# EAGLE board PolyDAC (EAGLE 5.11)
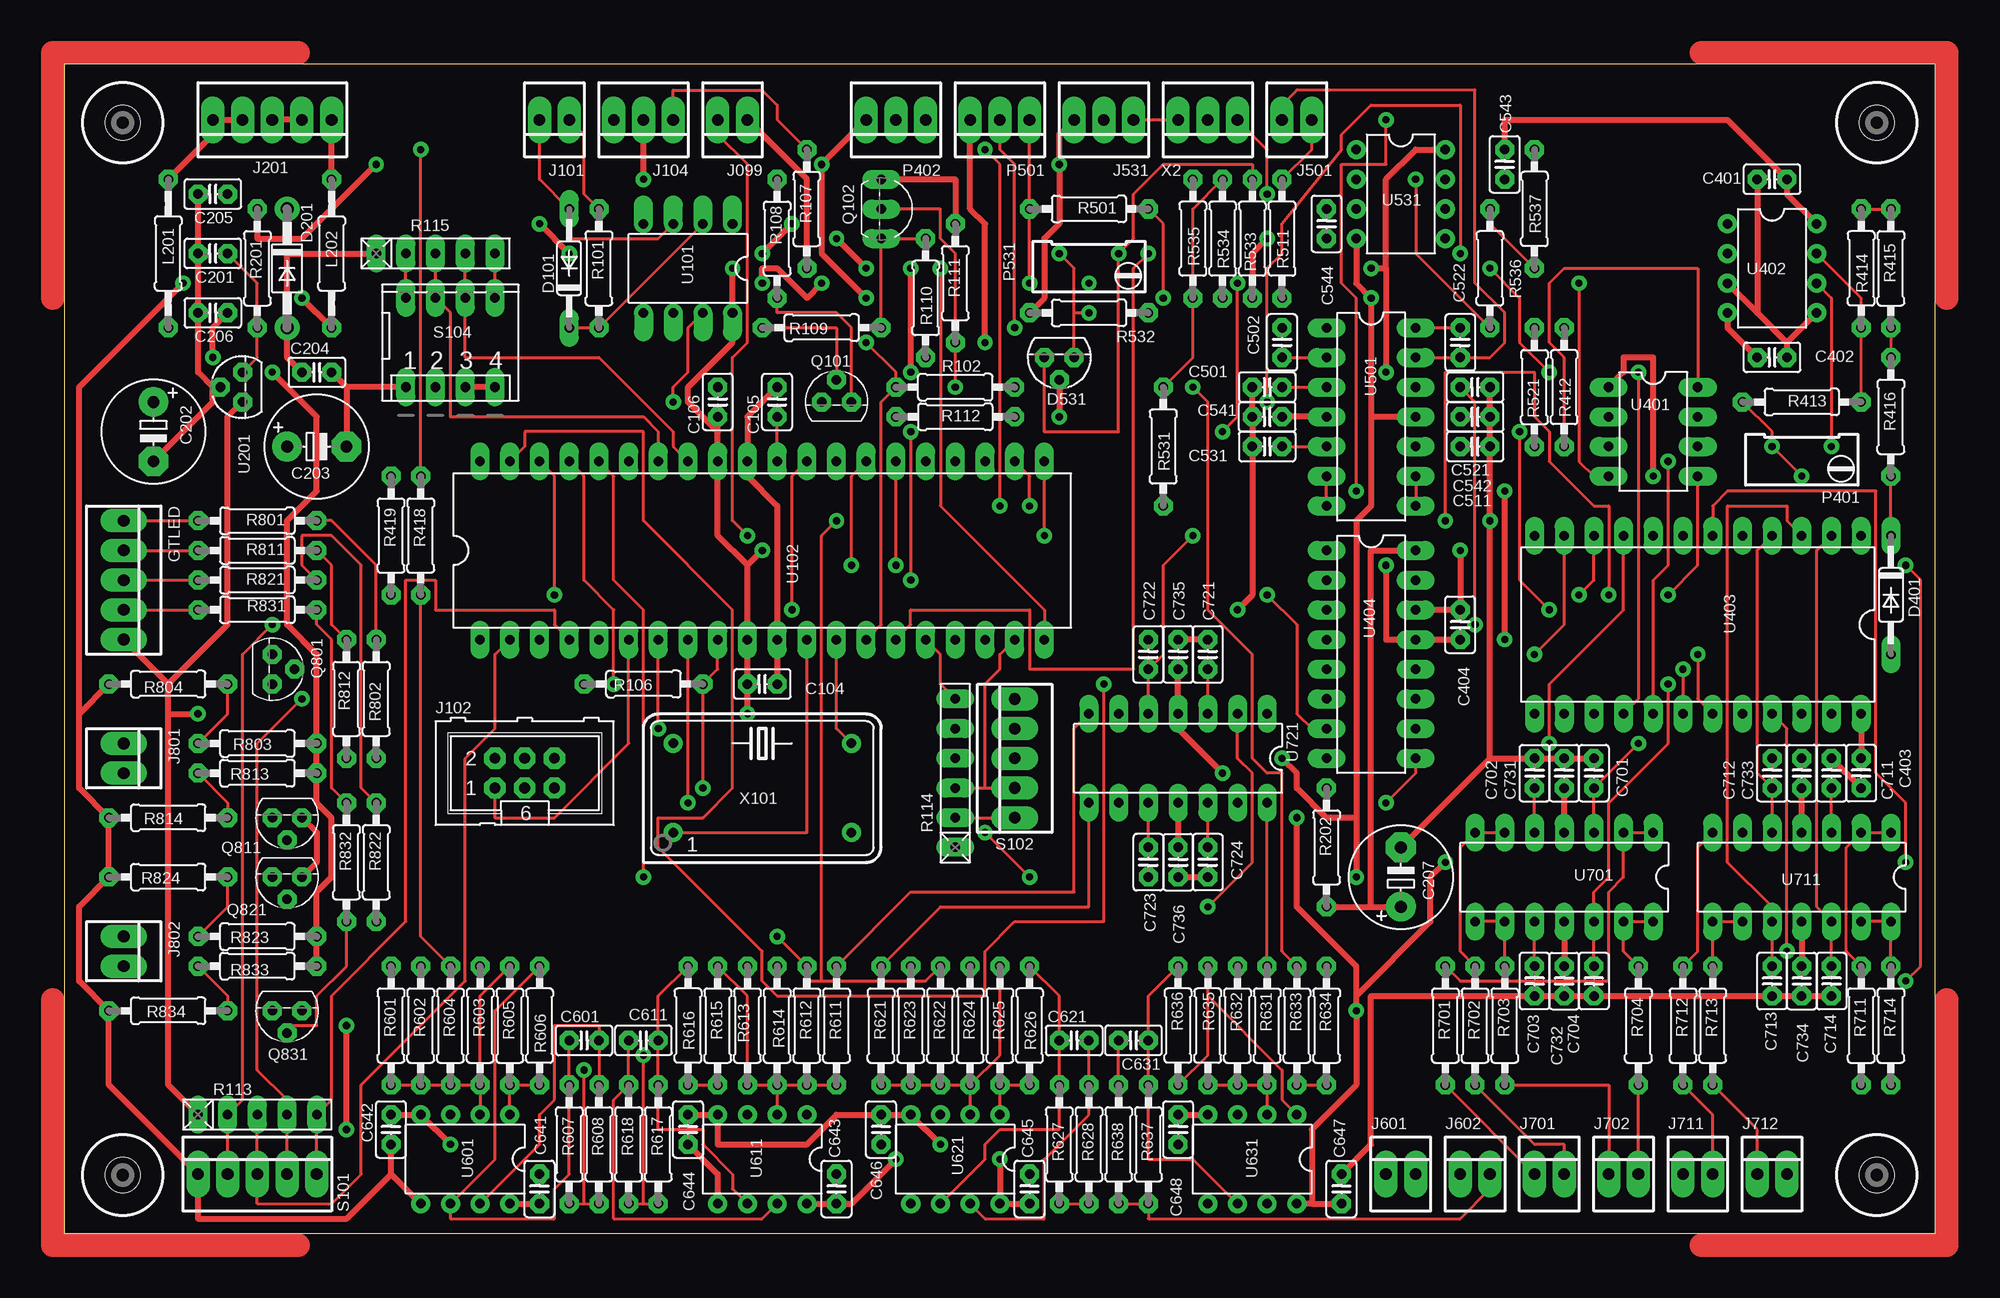
[diagram p8: board, top side]
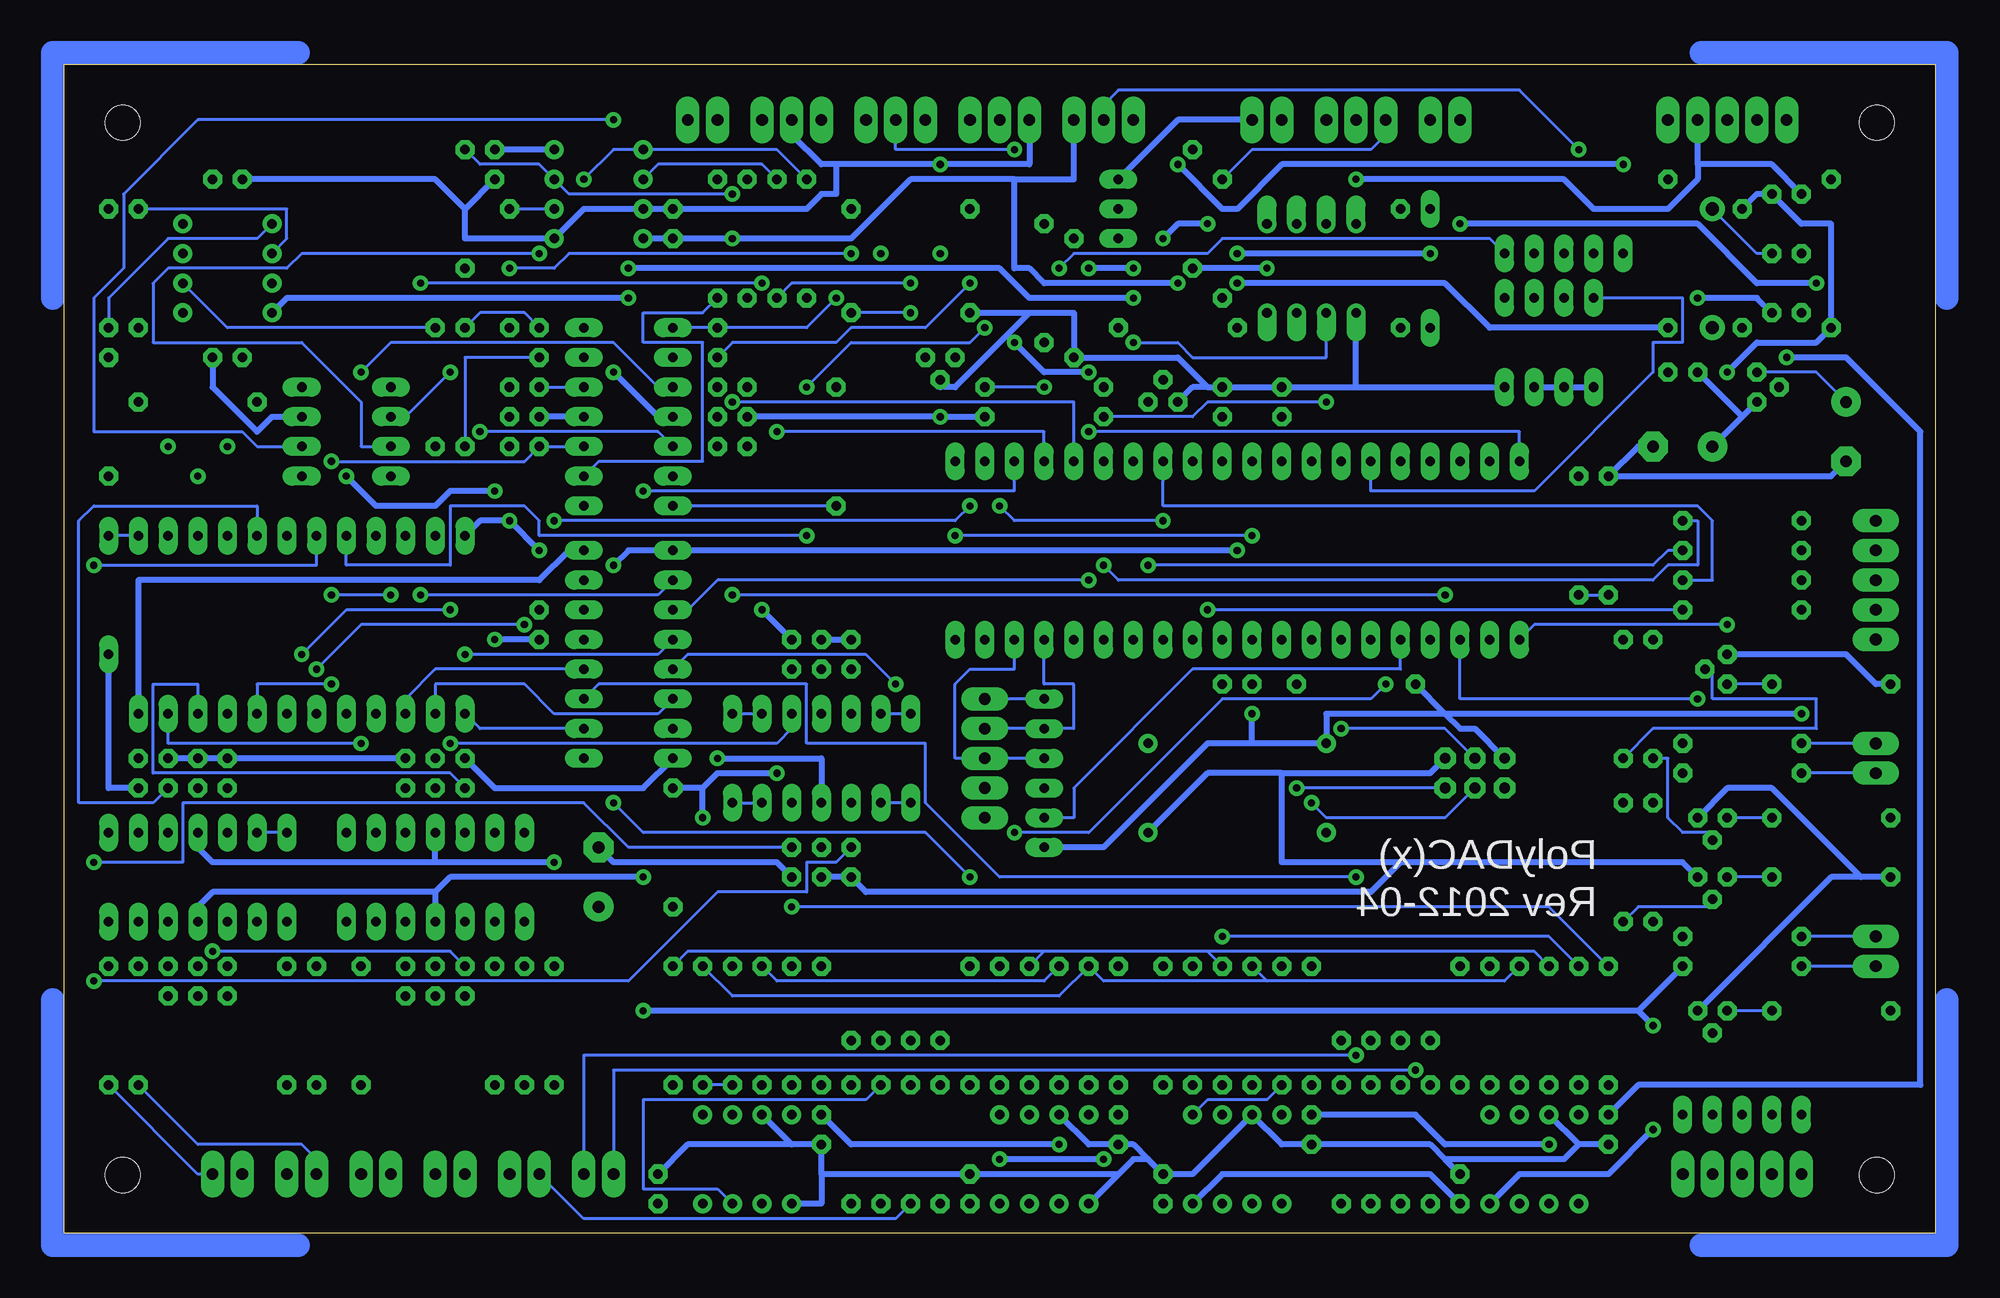
[diagram p9: board, bottom side, seen from below]

Size 160 x 100 mm. Coordinates in mm from the lower left corner, seen from the top.
Outline: 0,0 160,0 160,100 0,100 0,0
Copper layers (1*16): Top 0.035mm / dielectric 1.5mm / Bottom 0.035mm
Design rules "default *": minimum track width 10mil, minimum drill 24mil, track to track 12mil, track to pad 12mil, pad to pad 12mil, via to via 12mil, smd to smd 8mil, copper to edge 40mil, drill to drill 8mil, minimum pad ring 14mil, minimum via ring 14mil, stop-mask expansion 4mil, vias tented up to drill 0mil, thermal gap 10mil
Net classes: 1 bold: width 0.508 mm

## Footprints (pad centres in the part's own frame; a part is rotated, then mirrored left to right if it is on the bottom)
C025-025X050 = drill 0.813 octagon: 1 -1.27,0; 2 1.27,0
E5-8,5 = drill 1.016 pad 2.54 round: + -2.54,0 | drill 1.016 pad 2.54 octagon: - 2.54,0
DO35-10 = drill 0.813 long: A 5.08,0; C -5.08,0
DO41-10 = drill 1.118 round: A 5.08,0; C -5.08,0
TO92 = drill 0.813 octagon: 1 -1.27,0; 2 0,1.905; 3 1.27,0
22-23-2051 = drill 1 long: 1 -5.08,0; 2 -2.54,0; 3 0,0; 4 2.54,0; 5 5.08,0
22-23-2021 = drill 1 long: 1 -1.27,0; 2 1.27,0
ML6 = drill 0.914 octagon: 1 -2.54,-1.27; 2 -2.54,1.27; 3 0,-1.27; 4 0,1.27; 5 2.54,-1.27; 6 2.54,1.27
22-23-2031 = drill 1 long: 1 -2.54,0; 2 0,0; 3 2.54,0
0207/12 = drill 0.813 octagon: 1 -6.35,0; 2 6.35,0
RTRIM64Y = drill 0.61 round: 1 0,-2.54; 2 -2.54,0; 3 0,2.54
TO92' = drill 0.813 octagon: 1 1.27,0; 2 0,1.905; 3 -1.27,0
TO92-EBC = drill 0.813 long: B 0,-1.27; C 2.54,-1.27; E -2.54,-1.27
0207/10 = drill 0.813 octagon: 1 -5.08,0; 2 5.08,0
RN-5 = drill 0.813 long: 1 -5.08,0; 2 -2.54,0; 3 0,0; 4 2.54,0; 5 5.08,0
RN-6 = drill 0.813 long: 1 -6.35,0; 2 -3.81,0; 3 -1.27,0; 4 1.27,0; 5 3.81,0; 6 6.35,0
DP-04 = drill 0.813 long: 1 -3.81,-3.81; 2 -1.27,-3.81; 3 1.27,-3.81; 4 3.81,-3.81; 5 3.81,3.81; 6 1.27,3.81; 7 -1.27,3.81; 8 -3.81,3.81
DIL08 = drill 0.813 offset: 1 -3.81,-3.81; 2 -1.27,-3.81; 3 1.27,-3.81; 4 3.81,-3.81; 5 3.81,3.81; 6 1.27,3.81; 7 -1.27,3.81; 8 -3.81,3.81
DIL40 = drill 0.813 long: 1 -24.13,-7.62; 2 -21.59,-7.62; 3 -19.05,-7.62; 4 -16.51,-7.62; 5 -13.97,-7.62; 6 -11.43,-7.62; 7 -8.89,-7.62; 8 -6.35,-7.62; 9 -3.81,-7.62; 10 -1.27,-7.62; 11 1.27,-7.62; 12 3.81,-7.62; 13 6.35,-7.62; 14 8.89,-7.62; 15 11.43,-7.62; 16 13.97,-7.62; 17 16.51,-7.62; 18 19.05,-7.62; 19 21.59,-7.62; 20 24.13,-7.62; 21 24.13,7.62; 22 21.59,7.62; 23 19.05,7.62; 24 16.51,7.62; 25 13.97,7.62; 26 11.43,7.62; 27 8.89,7.62; 28 6.35,7.62; 29 3.81,7.62; 30 1.27,7.62; 31 -1.27,7.62; 32 -3.81,7.62; 33 -6.35,7.62; 34 -8.89,7.62; 35 -11.43,7.62; 36 -13.97,7.62; 37 -16.51,7.62; 38 -19.05,7.62; 39 -21.59,7.62; 40 -24.13,7.62
DIL08' = drill 0.813 long: 1 -3.81,-3.81; 2 -1.27,-3.81; 3 1.27,-3.81; 4 3.81,-3.81; 5 3.81,3.81; 6 1.27,3.81; 7 -1.27,3.81; 8 -3.81,3.81
DIL08'' = drill 0.813 pad 1.27 round: 1 -3.81,-3.81; 2 -1.27,-3.81; 3 1.27,-3.81; 4 3.81,-3.81; 5 3.81,3.81; 6 1.27,3.81; 7 -1.27,3.81; 8 -3.81,3.81
DIL24-6 = drill 0.813 long: 1 -13.97,-7.62; 2 -11.43,-7.62; 3 -8.89,-7.62; 4 -6.35,-7.62; 5 -3.81,-7.62; 6 -1.27,-7.62; 7 1.27,-7.62; 8 3.81,-7.62; 9 6.35,-7.62; 10 8.89,-7.62; 11 11.43,-7.62; 12 13.97,-7.62; 13 13.97,7.62; 14 11.43,7.62; 15 8.89,7.62; 16 6.35,7.62; 17 3.81,7.62; 18 1.27,7.62; 19 -1.27,7.62; 20 -3.81,7.62; 21 -6.35,7.62; 22 -8.89,7.62; 23 -11.43,7.62; 24 -13.97,7.62
DIL16 = drill 0.813 long: 1 -8.89,-3.81; 2 -6.35,-3.81; 3 -3.81,-3.81; 4 -1.27,-3.81; 5 1.27,-3.81; 6 3.81,-3.81; 7 6.35,-3.81; 8 8.89,-3.81; 9 8.89,3.81; 10 6.35,3.81; 11 3.81,3.81; 12 1.27,3.81; 13 -1.27,3.81; 14 -3.81,3.81; 15 -6.35,3.81; 16 -8.89,3.81
DIL14 = drill 0.813 long: 1 -7.62,-3.81; 2 -5.08,-3.81; 3 -2.54,-3.81; 4 0,-3.81; 5 2.54,-3.81; 6 5.08,-3.81; 7 7.62,-3.81; 8 7.62,3.81; 9 5.08,3.81; 10 2.54,3.81; 11 0,3.81; 12 -2.54,3.81; 13 -5.08,3.81; 14 -7.62,3.81
DRIL-3 = hole 3: 0,0
DIL14S = drill 0.813 round: 1 -7.62,-3.81; 7 7.62,-3.81; 8 7.62,3.81; 14 -7.62,3.81

## Placement (x,y rotation side)
C104  100nF  [C025-025X050]  59.69,46.99 180 top
C105  100nF  [C025-025X050]  60.96,71.12 90 top
C106  100nF  [C025-025X050]  55.88,71.12 90 top
C201  100nF  [C025-025X050]  12.7,83.82 180 top
C202  22µ 25V  [E5-8,5]  7.62,68.58 270 top
C203  22µ 25V  [E5-8,5]  21.59,67.31 0 top
C204  100nF  [C025-025X050]  21.59,73.66 0 top
C205  100nF  [C025-025X050]  12.7,88.9 180 top
C206  100nF  [C025-025X050]  12.7,78.74 0 top
C207  22µ 25V  [E5-8,5]  114.3,30.48 90 top
C401  100nF  [C025-025X050]  146.05,90.17 180 top
C402  100nF  [C025-025X050]  146.05,74.93 180 top
C403  100nF  [C025-025X050]  153.67,39.37 270 top
C404  100nF  [C025-025X050]  119.38,52.07 90 top
C501  10nF  [C025-025X050]  102.87,72.39 0 top
C502  33pF  [C025-025X050]  104.14,76.2 270 top
C511  10nF  [C025-025X050]  120.65,67.31 180 top
C521  10nF  [C025-025X050]  120.65,72.39 180 top
C522  33pF  [C025-025X050]  119.38,76.2 270 top
C531  10nF  [C025-025X050]  102.87,67.31 0 top
C541  100nF  [C025-025X050]  102.87,69.85 180 top
C542  100nF  [C025-025X050]  120.65,69.85 180 top
C543  100nF  [C025-025X050]  123.19,91.44 90 top
C544  100nF  [C025-025X050]  107.95,86.36 90 top
C601  33pF  [C025-025X050]  44.45,16.51 0 top
C611  33pF  [C025-025X050]  49.53,16.51 180 top
C621  33pF  [C025-025X050]  86.36,16.51 0 top
C631  33pF  [C025-025X050]  91.44,16.51 180 top
C641  100nF  [C025-025X050]  40.64,3.81 90 top
C642  100nF  [C025-025X050]  27.94,8.89 90 top
C643  100nF  [C025-025X050]  66.04,3.81 90 top
C644  100nF  [C025-025X050]  53.34,8.89 90 top
C645  100nF  [C025-025X050]  82.55,3.81 90 top
C646  100nF  [C025-025X050]  69.85,8.89 90 top
C647  100nF  [C025-025X050]  109.22,3.81 90 top
C648  100nF  [C025-025X050]  95.25,8.89 90 top
C701  10nF  [C025-025X050]  130.81,39.37 90 top
C702  10nF  [C025-025X050]  125.73,39.37 90 top
C703  10nF  [C025-025X050]  125.73,21.59 270 top
C704  10nF  [C025-025X050]  130.81,21.59 270 top
C711  10nF  [C025-025X050]  151.13,39.37 90 top
C712  10nF  [C025-025X050]  146.05,39.37 90 top
C713  10nF  [C025-025X050]  146.05,21.59 270 top
C714  10nF  [C025-025X050]  151.13,21.59 270 top
C721  10nF  [C025-025X050]  97.79,49.53 90 top
C722  10nF  [C025-025X050]  92.71,49.53 90 top
C723  10nF  [C025-025X050]  92.71,31.75 270 top
C724  10nF  [C025-025X050]  97.79,31.75 270 top
C731  100nF  [C025-025X050]  128.27,39.37 90 top
C732  100nF  [C025-025X050]  128.27,21.59 90 top
C733  100nF  [C025-025X050]  148.59,39.37 90 top
C734  100nF  [C025-025X050]  148.59,21.59 90 top
C735  100nF  [C025-025X050]  95.25,49.53 90 top
C736  100nF  [C025-025X050]  95.25,31.75 90 top
D101  1N4148  [DO35-10]  43.18,82.55 90 top
D201  1N4004  [DO41-10]  19.05,82.55 270 top
D401  BAT42  [DO35-10]  156.21,54.61 270 top
D531  LM336LP  [TO92]  85.09,74.93 180 top
GTLED  GATELED  [22-23-2051]  5.08,55.88 270 top
J099  MIDI-LED  [22-23-2021]  57.15,95.25 180 top
J101  MIDI-IN  [22-23-2021]  41.91,95.25 180 top
J102  ISP  [ML6]  39.37,39.37 0 top
J104  MIDI-THRU  [22-23-2031]  49.53,95.25 180 top
J201  POWER IN  [22-23-2051]  17.78,95.25 180 top
J501  SUSTAIN AFTERTOUCH  [22-23-2021]  105.41,95.25 180 top
J531  PITCH CV  [22-23-2031]  88.9,95.25 180 top
J601  NOTE 0/1  [22-23-2021]  114.3,5.08 0 top
J602  NOTE 2/3  [22-23-2021]  120.65,5.08 0 top
J701  CC 1/2  [22-23-2021]  127,5.08 0 top
J702  CC 3/4  [22-23-2021]  133.35,5.08 0 top
J711  VELO 0/1  [22-23-2021]  139.7,5.08 0 top
J712  VELO 3/4  [22-23-2021]  146.05,5.08 0 top
J801  GATE 1/2  [22-23-2021]  5.08,40.64 270 top
J802  GATE 3/4  [22-23-2021]  5.08,24.13 270 top
L201  1mH  [0207/12]  8.89,83.82 270 top
L202  1mH  [0207/12]  22.86,83.82 270 top
P401  2K 25T  [RTRIM64Y]  148.59,67.31 90 top
P402  TUNE  [22-23-2031]  71.12,95.25 180 top
P501  MODWHEEL/PITCH  [22-23-2031]  80.01,95.25 180 top
P531  10K 25T  [RTRIM64Y]  87.63,83.82 90 top
Q101  2N3904  [TO92']  66.04,71.12 0 top
Q102  2N3906  [TO92-EBC]  71.12,87.63 270 top
Q801  2N3904  [TO92']  17.78,48.26 270 top
Q811  2N3904  [TO92']  19.05,35.56 180 top
Q821  2N3904  [TO92']  19.05,30.48 180 top
Q831  2N3904  [TO92']  19.05,19.05 180 top
R101  220R  [0207/10]  45.72,82.55 270 top
R102  1K5  [0207/10]  76.2,72.39 0 top
R106  10K  [0207/10]  49.53,46.99 0 top
R107  220R  [0207/10]  63.5,87.63 270 top
R108  220R  [0207/10]  60.96,85.09 270 top
R109  4K7  [0207/10]  64.77,77.47 0 top
R110  33K  [0207/10]  73.66,80.01 90 top
R111  220R  [0207/10]  76.2,81.28 270 top
R112  15K  [0207/10]  76.2,69.85 180 top
R113  4x 1K  [RN-5]  16.51,10.16 0 top
R114  5 x 1K  [RN-6]  76.2,39.37 90 top
R115  4 x 1K  [RN-5]  31.75,83.82 0 top
R201  56R  [0207/10]  16.51,82.55 270 top
R202  100R  [0207/10]  107.95,33.02 270 top
R412  4K7  [0207/10]  128.27,72.39 90 top
R413  11K5  [0207/10]  148.59,71.12 180 top
R414  11K  [0207/10]  153.67,82.55 90 top
R415  22K  [0207/10]  156.21,82.55 270 top
R416  10R  [0207/10]  156.21,69.85 270 top
R418  10k  [0207/10]  30.48,59.69 270 top
R419  1k  [0207/10]  27.94,59.69 270 top
R501  75R  [0207/10]  87.63,87.63 180 top
R511  75R  [0207/10]  104.14,85.09 90 top
R521  75R  [0207/10]  125.73,72.39 270 top
R531  47K  [0207/10]  93.98,67.31 90 top
R532  4K7  [0207/10]  87.63,78.74 180 top
R533  3K3  [0207/10]  101.6,85.09 90 top
R534  47K  [0207/10]  99.06,85.09 90 top
R535  47K  [0207/10]  96.52,85.09 90 top
R536  47K  [0207/10]  121.92,82.55 90 top
R537  10K  [0207/10]  125.73,87.63 90 top
R601  10K  [0207/10]  27.94,17.78 270 top
R602  10K  [0207/10]  30.48,17.78 270 top
R603  10K  [0207/10]  35.56,17.78 270 top
R604  10K  [0207/10]  33.02,17.78 270 top
R605  10K  [0207/10]  38.1,17.78 270 top
R606  10K  [0207/10]  40.64,17.78 90 top
R607  10K  [0207/10]  43.18,7.62 270 top
R608  75R  [0207/10]  45.72,7.62 270 top
R611  10K  [0207/10]  66.04,17.78 270 top
R612  10K  [0207/10]  63.5,17.78 270 top
R613  10K  [0207/10]  58.42,17.78 270 top
R614  10K  [0207/10]  60.96,17.78 270 top
R615  10K  [0207/10]  55.88,17.78 270 top
R616  10K  [0207/10]  53.34,17.78 90 top
R617  10K  [0207/10]  50.8,7.62 270 top
R618  75R  [0207/10]  48.26,7.62 270 top
R621  10K  [0207/10]  69.85,17.78 270 top
R622  10K  [0207/10]  74.93,17.78 270 top
R623  10K  [0207/10]  72.39,17.78 270 top
R624  10K  [0207/10]  77.47,17.78 270 top
R625  10K  [0207/10]  80.01,17.78 270 top
R626  10K  [0207/10]  82.55,17.78 90 top
R627  10K  [0207/10]  85.09,7.62 270 top
R628  75R  [0207/10]  87.63,7.62 270 top
R631  10K  [0207/10]  102.87,17.78 270 top
R632  10K  [0207/10]  100.33,17.78 270 top
R633  10K  [0207/10]  105.41,17.78 270 top
R634  10K  [0207/10]  107.95,17.78 270 top
R635  10K  [0207/10]  97.79,17.78 90 top
R636  10K  [0207/10]  95.25,17.78 90 top
R637  10K  [0207/10]  92.71,7.62 270 top
R638  75R  [0207/10]  90.17,7.62 270 top
R701  75R  [0207/10]  118.11,17.78 270 top
R702  75R  [0207/10]  120.65,17.78 270 top
R703  75R  [0207/10]  123.19,17.78 270 top
R704  75R  [0207/10]  134.62,17.78 270 top
R711  75R  [0207/10]  153.67,17.78 270 top
R712  75R  [0207/10]  138.43,17.78 270 top
R713  75R  [0207/10]  140.97,17.78 270 top
R714  75R  [0207/10]  156.21,17.78 270 top
R801  1K  [0207/10]  16.51,60.96 180 top
R802  3K3  [0207/10]  26.67,45.72 270 top
R803  10K  [0207/10]  16.51,41.91 0 top
R804  10K  [0207/10]  8.89,46.99 0 top
R811  1K  [0207/10]  16.51,58.42 180 top
R812  3K3  [0207/10]  24.13,45.72 270 top
R813  10K  [0207/10]  16.51,39.37 0 top
R814  10K  [0207/10]  8.89,35.56 0 top
R821  1K  [0207/10]  16.51,55.88 180 top
R822  3K3  [0207/10]  26.67,31.75 270 top
R823  10K  [0207/10]  16.51,25.4 0 top
R824  10K  [0207/10]  8.89,30.48 0 top
R831  1K  [0207/10]  16.51,53.34 180 top
R832  3K3  [0207/10]  24.13,31.75 270 top
R833  10K  [0207/10]  16.51,22.86 0 top
R834  10K  [0207/10]  8.89,19.05 0 top
S101  MIDI ADDRESS  [22-23-2051]  16.51,5.08 0 top
S102  OPTIONS  [22-23-2051]  81.28,40.64 90 top
S104  DIPSW4  [DP-04]  33.02,76.2 0 top
U101  6N138  [DIL08]  53.34,82.55 180 top
U102  MEGA16-P  [DIL40]  59.69,58.42 0 top
U201  7805L  [TO92]  15.24,72.39 90 top
U401  AD8300  [DIL08']  135.89,68.58 270 top
U402  AD712N  [DIL08'']  146.05,82.55 270 top
U403  4067N  [DIL24-6]  139.7,52.07 180 top
U404  4504N  [DIL16]  111.76,49.53 270 top
U501  TL074P  [DIL14]  111.76,69.85 270 top
U531  LF412N  [DIL08'']  114.3,88.9 270 top
U601  LF412N  [DIL08'']  34.29,6.35 180 top
U611  LF412N  [DIL08'']  59.69,6.35 180 top
U621  LF412N  [DIL08'']  76.2,6.35 180 top
U631  LF412N  [DIL08'']  101.6,6.35 180 top
U701  TL074P  [DIL14]  128.27,30.48 180 top
U711  TL074P  [DIL14]  148.59,30.48 180 top
U721  TL074P  [DIL14]  95.25,40.64 180 top
U$1  [DRIL-3]  5,5 0 top
U$2  [DRIL-3]  155,5 0 top
U$3  [DRIL-3]  5,95 0 top
U$4  [DRIL-3]  155,95 0 top
X2  BEND RANGE  [22-23-2031]  97.79,95.25 180 top
X101  16 MHZ  [DIL14S]  59.69,38.1 0 top

## Tracks (layer width: path | path; a pad name or v marks a point on that pad's centre or on a via)
+5V  (via drill 0.61)
  Top 0.508: C204.1 19.05,74.93 D201.A 19.05,83.82 R115.1 | R113.1 8.89,12.7 8.89,44.45 | 8.89,44.45 8.89,46.99 | 8.89,46.99 GTLED.5 | U201.1 13.97,69.85 13.97,52.07 8.89,46.99 | C404.1 U404.13 113.03,50.8 v113.03,57.15 | U401.1 133.35,73.66 133.35,74.93 135.89,74.93 v135.89,64.77 | v123.19,50.8 v123.19,63.5 | Q102.E 76.2,90.17 R111.1 | R107.2 63.5,90.17 J099.1 | 55.88,68.58 C106.1 | 55.88,68.58 U102.32 55.88,59.69 58.42,57.15 | 55.88,68.58 53.34,71.12 53.34,72.39 57.15,76.2 U101.8 v57.15,82.55 | 58.42,57.15 v59.69,58.42 | 58.42,57.15 U102.10 C104.2 v58.42,44.45 | 8.89,44.45 v11.43,44.45
  Bottom 0.508: 16.51,69.85 C203.+ | U201.1 16.51,69.85 | 16.51,69.85 C204.1 | 41.91,44.45 40.64,43.18 39.37,43.18 J102.2 | 41.91,44.45 R106.1 | 41.91,44.45 52.07,44.45 X101.14 58.42,41.91 | R114.1 71.12,33.02 62.23,41.91 58.42,41.91 | v135.89,64.77 133.35,62.23 128.27,62.23 127,63.5 v123.19,63.5 | C404.1 v123.19,50.8 | Q102.E 64.77,95.25 J099.1 | v59.69,58.42 U404.1 111.76,58.42 v113.03,57.15 | v57.15,82.55 R107.2 | 58.42,41.91 v58.42,44.45 | v11.43,44.45 41.91,44.45
+15V  (via drill 0.61)
  Top 0.508: U402.8 147.32,88.9 C401.1 142.24,95.25 123.19,95.25 C543.2 | U501.4 C541.1 | 113.03,82.55 113.03,90.17 115.57,92.71 U531.8 | 113.03,82.55 v113.03,73.66 | P402.3 v64.77,91.44 64.77,83.82 v68.58,80.01 | v26.67,91.44 20.32,85.09 16.51,85.09 R201.1 | v111.76,82.55 113.03,82.55 | C645.1 U621.8 v80.01,6.35 | U601.8 C641.1 | U611.8 C643.1 67.31,2.54 v71.12,6.35 | U701.4 C731.1 | U711.4 C733.1 | R833.2 R823.2 21.59,29.21 22.86,30.48 22.86,35.56 21.59,36.83 R813.2 R803.2 21.59,49.53 19.05,52.07 19.05,60.96 21.59,63.5 21.59,69.85 v17.78,73.66 | 106.68,2.54 C647.1 | 106.68,2.54 U631.8 | C735.1 U721.4 95.25,43.18 v99.06,39.37 | 106.68,2.54 106.68,8.89 110.49,12.7 v110.49,19.05 110.49,20.32 | 110.49,20.32 110.49,22.86 105.41,27.94 v105.41,35.56 | v118.11,31.75 116.84,30.48 116.84,26.67 110.49,20.32 | v24.13,8.89 v24.13,17.78
  Bottom 0.508: U531.8 C543.2 | U501.4 109.22,69.85 v113.03,73.66 | R201.1 15.24,88.9 C205.1 11.43,86.36 8.89,86.36 L201.2 10.16,76.2 15.24,76.2 v17.78,73.66 | v64.77,91.44 60.96,87.63 59.69,87.63 55.88,91.44 v26.67,91.44 | v111.76,82.55 80.01,82.55 77.47,80.01 v68.58,80.01 | C641.1 43.18,5.08 60.96,5.08 U611.8 | v71.12,6.35 v80.01,6.35 | 128.27,31.75 U701.4 | 128.27,31.75 147.32,31.75 148.59,33.02 U711.4 | 105.41,38.1 R202.1 | 105.41,38.1 104.14,39.37 v99.06,39.37 | v105.41,35.56 105.41,38.1 | 25.4,19.05 R833.2 | 25.4,19.05 v110.49,19.05 | v118.11,31.75 128.27,31.75 | U601.8 35.56,5.08 27.94,5.08 v24.13,8.89 | v24.13,17.78 25.4,19.05
+15VF
  Top 0.508: U403.24 C403.1 | 111.76,27.94 C207.+ | R202.2 111.76,27.94 | U404.16 111.76,58.42 111.76,27.94
  Bottom 0.508: U403.24 153.67,55.88 119.38,55.88 116.84,58.42 U404.16
-15V  (via drill 0.61)
  Top 0.508: U701.11 C732.2 | U711.11 C734.2 | C402.2 142.24,77.47 U402.4 | U721.11 C736.2 | v102.87,85.09 101.6,83.82 R533.1 | v104.14,40.64 105.41,39.37 105.41,38.1 107.95,35.56 110.49,35.56 | 110.49,35.56 110.49,60.96 111.76,62.23 111.76,69.85 | 111.76,69.85 v111.76,80.01 110.49,81.28 U531.4 | 111.76,69.85 U501.11 | 110.49,35.56 v110.49,30.48 | v20.32,80.01 L202.2 | C648.2 U631.4 | C642.2 U601.4 v33.02,7.62 | C644.2 U611.4 55.88,7.62 63.5,7.62 66.04,10.16 C646.2 U621.4 v74.93,7.62 | C206.2 12.7,77.47 v12.7,74.93 | v64.77,81.28 63.5,80.01 60.96,82.55 59.69,82.55 v59.69,81.28
  Bottom 0.508: 128.27,29.21 U701.11 | 128.27,29.21 147.32,29.21 148.59,27.94 U711.11 | U501.11 C542.2 | U531.4 C544.1 v102.87,85.09 92.71,85.09 87.63,90.17 78.74,90.17 | P402.1 73.66,90.17 78.74,90.17 | U721.11 95.25,40.64 v104.14,40.64 | U402.4 140.97,80.01 v111.76,80.01 | 128.27,29.21 127,30.48 v110.49,30.48 | C206.2 15.24,80.01 v20.32,80.01 | v33.02,7.62 41.91,7.62 44.45,10.16 C644.2 | C648.2 92.71,7.62 v74.93,7.62 | v12.7,74.93 7.62,74.93 1.27,68.58 1.27,12.7 25.4,12.7 C642.2 | 78.74,90.17 78.74,82.55 77.47,82.55 76.2,81.28 v64.77,81.28 | v59.69,81.28 41.91,81.28 38.1,77.47 L202.2
CC_0  (via drill 0.61)
  Top 0.254: U701.3 C701.1 v134.62,41.91
  Bottom 0.254: U403.23 151.13,41.91 v134.62,41.91
CC_1
  Top 0.254: U701.5 C702.1
  Bottom 0.254: U403.22 148.59,46.99 152.4,46.99 152.4,39.37 127,39.37 C702.1
CC_2  (via drill 0.61)
  Top 0.254: C703.1 U701.10 | U403.21 147.32,43.18 v147.32,24.13
  Bottom 0.254: v147.32,24.13 127,24.13 C703.1
CC_3  (via drill 0.61)
  Top 0.254: C704.1 U701.12 130.81,29.21 132.08,30.48 132.08,36.83 137.16,41.91 v137.16,46.99
  Bottom 0.254: U403.20 143.51,46.99 v137.16,46.99
CV_0  (via drill 0.61)
  Top 0.254: C531.2 U501.5 | U403.19 139.7,45.72 v139.7,49.53 | v127,53.34 124.46,55.88 v124.46,68.58
  Bottom 0.254: v139.7,49.53 135.89,53.34 v127,53.34 | v124.46,68.58 109.22,68.58 U501.5
CV_1  (via drill 0.61)
  Top 0.254: v138.43,48.26 U403.18 | v120.65,52.07 120.65,71.12 C521.2
  Bottom 0.254: C521.2 U501.12 | v138.43,48.26 134.62,52.07 v120.65,52.07
CV_2  (via drill 0.61)
  Top 0.254: U403.17 135.89,55.88 137.16,57.15 v137.16,66.04
  Bottom 0.254: U501.10 C511.2 120.65,66.04 v137.16,66.04
CV_3  (via drill 0.61)
  Top 0.254: C501.2 U501.3 | U403.16 134.62,45.72 v134.62,73.66
  Bottom 0.254: v134.62,73.66 132.08,76.2 113.03,76.2 109.22,72.39 U501.3
GATE-LED1
  Top 0.254: GTLED.1 R801.2
GATE-LED2
  Top 0.254: GTLED.2 R811.2
GATE-LED3
  Top 0.254: GTLED.3 R821.2
GATE-LED4
  Top 0.254: GTLED.4 R831.2
GATEOUT1
  Top 0.254: R803.1 13.97,44.45 R804.2
  Bottom 0.254: R804.2 Q801.1 | J801.1 R803.1
GATEOUT2
  Top 0.254: R813.1 13.97,36.83 R814.2
  Bottom 0.254: R814.2 Q811.1 | J801.2 R813.1
GATEOUT3
  Top 0.254: R823.1 13.97,27.94 R824.2
  Bottom 0.254: R824.2 Q821.1 | J802.1 R823.1
GATEOUT4
  Top 0.254: R833.1 13.97,20.32 R834.2
  Bottom 0.254: R834.2 Q831.1 | J802.2 R833.1
GND  (via drill 0.61)
  Top 0.508: 144.78,78.74 147.32,76.2 | 144.78,78.74 U402.3 | 147.32,76.2 C402.1 | C401.2 144.78,78.74 | 147.32,76.2 U402.5 | C205.2 C201.2 C206.1 11.43,73.66 12.7,72.39 | C202.- 12.7,71.12 12.7,72.39 | 12.7,72.39 U201.2 | J201.2 J201.3 | v49.53,90.17 J104.2 | C721.2 C735.2 | C501.1 C541.2 C531.1 101.6,54.61 v100.33,53.34 | J531.3 85.09,93.98 v85.09,91.44 85.09,86.36 83.82,85.09 83.82,80.01 R532.2 | S104.4 S104.3 | 24.13,72.39 C204.2 | 24.13,72.39 C203.- | S104.1 24.13,72.39 | C104.1 U102.11 60.96,62.23 58.42,64.77 U102.31 58.42,69.85 C105.2 | D531.2 v85.09,69.85 | 27.94,5.08 U601.5 | 27.94,5.08 C642.1 | U611.5 55.88,5.08 C644.1 | C714.2 C734.1 C713.2 C704.2 C732.1 C703.2 111.76,20.32 111.76,7.62 C647.2 | U404.14 C404.2 v119.38,58.42 | C521.1 C542.1 C511.1 v121.92,60.96 121.92,40.64 | C736.1 C724.2 | C711.2 C403.2 | C701.2 C731.2 C702.2 121.92,40.64 | C207.- 121.92,40.64 | Q821.3 21.59,31.75 21.59,34.29 Q811.3 | 1.27,44.45 R804.1 | 1.27,44.45 1.27,38.1 R814.1 R824.1 1.27,27.94 1.27,21.59 R834.1 3.81,12.7 S101.1 11.43,1.27 24.13,1.27 27.94,5.08 | P501.3 77.47,87.63 78.74,86.36 v78.74,76.2 | v72.39,82.55 v72.39,73.66 | v66.04,85.09 v68.58,82.55 | v59.69,83.82 v62.23,86.36 | v40.64,86.36 v43.18,83.82 | v10.16,81.28 1.27,72.39 1.27,44.45
  Bottom 0.508: P501.3 77.47,91.44 v85.09,91.44 93.98,91.44 | 93.98,91.44 95.25,91.44 97.79,93.98 X2.2 | 125.73,87.63 C543.1 | 125.73,87.63 125.73,85.09 U531.5 115.57,87.63 U531.3 C544.2 96.52,87.63 95.25,88.9 93.98,88.9 93.98,91.44 | U401.7 142.24,69.85 143.51,68.58 147.32,72.39 C402.1 | 125.73,87.63 128.27,90.17 C401.2 | v49.53,90.17 31.75,90.17 29.21,87.63 22.86,87.63 20.32,90.17 20.32,91.44 | 20.32,91.44 J201.2 | C205.2 13.97,91.44 20.32,91.44 | C735.2 C722.2 | C541.2 v85.09,69.85 R112.1 | v100.33,53.34 C721.2 | R532.2 77.47,78.74 | 77.47,78.74 73.66,78.74 R110.1 64.77,74.93 62.23,72.39 | 77.47,78.74 83.82,72.39 85.09,72.39 D531.2 | S104.1 S104.2 S104.3 | C203.- 25.4,67.31 R419.1 8.89,64.77 C202.- | Q101.3 63.5,72.39 62.23,72.39 | 62.23,72.39 C105.2 C106.2 49.53,72.39 | 49.53,72.39 U101.5 | 49.53,72.39 S104.4 | 30.48,7.62 U601.3 | C642.1 30.48,7.62 | 41.91,6.35 43.18,7.62 C644.1 55.88,7.62 U611.3 63.5,5.08 C643.2 67.31,6.35 | 41.91,6.35 C641.2 | 30.48,7.62 31.75,6.35 41.91,6.35 | 95.25,5.08 95.25,2.54 U631.5 | 95.25,5.08 C648.1 97.79,7.62 | 97.79,7.62 U631.3 | C647.2 106.68,7.62 97.79,7.62 | 67.31,6.35 68.58,7.62 C646.1 72.39,7.62 U621.3 | 69.85,5.08 68.58,6.35 67.31,6.35 | 69.85,5.08 U621.5 | 69.85,5.08 C645.2 95.25,5.08 | U403.12 124.46,60.96 v121.92,60.96 v119.38,58.42 | C736.1 C723.2 91.44,29.21 48.26,29.21 45.72,31.75 | C724.2 99.06,31.75 113.03,31.75 C207.- | C711.2 C733.2 C712.2 C701.2 | D401.A 156.21,38.1 C403.2 | U404.8 110.49,38.1 123.19,38.1 C702.2 | X101.7 62.23,39.37 55.88,39.37 | 55.88,39.37 43.18,39.37 J102.6 | Q831.3 8.89,30.48 6.35,30.48 | R824.1 6.35,30.48 | Q801.3 7.62,49.53 5.08,46.99 R804.1 | Q811.3 17.78,38.1 13.97,38.1 6.35,30.48
  Bottom 0.508: 55.88,39.37 55.88,31.75 45.72,31.75 | 45.72,31.75 21.59,31.75 Q821.3 | v78.74,76.2 76.2,73.66 v72.39,73.66 | v68.58,82.55 v72.39,82.55 | v66.04,85.09 64.77,86.36 v62.23,86.36 | v43.18,83.82 v59.69,83.82 | v40.64,86.36 20.32,86.36 15.24,81.28 v10.16,81.28
N$1  (via drill 0.61)
  Top 0.254: R418.1 v30.48,92.71
  Bottom 0.254: v30.48,92.71 35.56,97.79 69.85,97.79 71.12,96.52 P402.2
N$2  (via drill 0.61)
  Top 0.254: v129.54,54.61 130.81,55.88 U403.10
  Bottom 0.254: U404.2 109.22,54.61 v129.54,54.61
N$3  (via drill 0.61)
  Top 0.254: v125.73,49.53 128.27,52.07 U403.11
  Bottom 0.254: U404.4 109.22,49.53 v125.73,49.53
N$4
  Bottom 0.254: U403.14 128.27,46.99 120.65,46.99 118.11,44.45 109.22,44.45 U404.6
N$5
  Bottom 0.254: U404.10 124.46,43.18 U403.13
N$6
  Bottom 0.254: U404.12 128.27,48.26 130.81,45.72 U403.15
N$7
  Top 0.254: D401.C R416.2
  Bottom 0.254: U403.1 D401.C
N$8
  Top 2: 20,-1 -1,-1 -1,20
N$9
  Top 2: 140,-1 161,-1 161,20
N$10
  Top 0.254: R415.2 R416.1
  Bottom 0.254: U402.1 143.51,85.09 151.13,85.09 156.21,80.01 R415.2
N$11
  Top 2: 20,101 -1,101 -1,80
N$12
  Top 0.254: R412.1 128.27,74.93 127,76.2 127,81.28 128.27,82.55 139.7,82.55 U401.8
N$13
  Top 0.254: R414.2 R415.1
  Bottom 0.254: U402.2 140.97,85.09 140.97,87.63 R414.2
N$14
  Top 0.254: R413.1 R414.1 153.67,80.01 U402.7
N$15
  Top 0.254: P401.2 P401.3 146.05,68.58 R413.2
N$16
  Top 0.254: R107.1 60.96,95.25 60.96,96.52 59.69,97.79 52.07,97.79 J104.1
N$17
  Top 0.254: P401.1 151.13,80.01 U402.6
  Bottom 0.254: R412.2 146.05,77.47 U402.6
N$18
  Top 2: 161,80 161,101 140,101
N$19
  Bottom 0.254: R108.1 58.42,92.71 48.26,92.71 46.99,93.98 J104.3
N$20
  Top 0.254: Q101.1 67.31,77.47 66.04,78.74 60.96,78.74 R108.2
N$21
  Top 0.254: R109.1 66.04,77.47 Q101.2
N$22
  Top 0.254: R109.2 Q102.C R110.2
N$23
  Bottom 2: 20,-1 -1,-1 -1,20
N$24
  Top 0.254: D101.C R101.2 U101.2
N$25  (via drill 0.61)
  Top 0.254: v76.2,72.39 R111.2 76.2,83.82 74.93,85.09 74.93,87.63 Q102.B
  Bottom 0.254: v76.2,72.39 R102.2
N$26
  Top 0.254: R101.1 44.45,88.9 44.45,93.98 J101.1
N$27
  Top 0.254: J101.2 40.64,90.17 D101.A 43.18,85.09 50.8,85.09 U101.3
N$28
  Top 0.254: X101.8 66.04,43.18 U102.13
N$29
  Top 0.254: X101.1 63.5,34.29 U102.12
N$30  (via drill 0.61)
  Top 0.254: U101.7 53.34,77.47 53.34,73.66 52.07,72.39 v52.07,71.12
  Bottom 0.254: v52.07,71.12 62.23,71.12 63.5,69.85 R112.2
N$31  (via drill 0.61)
  Top 0.254: C502.2 U501.2 | P501.1 R501.2 v82.55,81.28
  Bottom 0.254: C502.2 102.87,76.2 93.98,76.2 92.71,77.47 86.36,77.47 v82.55,81.28
N$32
  Top 0.254: U102.30 C105.1
N$33  (via drill 0.61)
  Top 0.254: R501.1 93.98,86.36 v93.98,80.01
  Bottom 0.254: U501.1 C502.1 96.52,77.47 v93.98,80.01
N$34
  Bottom 2: 140,-1 161,-1 161,20
N$35
  Top 0.254: U501.9 U501.8
  Bottom 0.254: R511.1 105.41,78.74 110.49,78.74 110.49,76.2 105.41,76.2 105.41,66.04 114.3,66.04 U501.9
N$36
  Top 0.254: U501.14 C522.1
  Bottom 0.254: R521.1 124.46,78.74 120.65,78.74 C522.1
N$37
  Top 0.254: U501.13 C522.2 121.92,74.93 123.19,76.2 123.19,78.74 120.65,81.28 120.65,97.79 105.41,97.79 104.14,96.52 J501.2
  Bottom 0.254: R521.2 125.73,74.93 C522.2
N$38
  Top 0.254: R511.2 106.68,92.71 J501.1
N$39
  Top 0.254: U501.7 U501.6
  Bottom 0.254: R531.1 U501.7
N$40  (via drill 0.61)
  Top 0.254: P531.3 86.36,82.55 86.36,78.74 | D531.1 86.36,78.74 | 86.36,78.74 v87.63,78.74
  Bottom 0.254: v87.63,78.74 R532.1
N$41
  Bottom 0.254: P531.2 97.79,81.28 R534.1
N$42
  Top 0.254: R533.2 101.6,91.44 93.98,91.44 91.44,88.9 91.44,85.09 P531.1 90.17,68.58 83.82,68.58 D531.3
N$43
  Top 0.254: R531.2 96.52,74.93 R535.1 96.52,87.63 R534.2
  Bottom 0.254: U531.2 109.22,91.44 100.33,91.44 R534.2
N$44  (via drill 0.61)
  Top 0.254: R536.1 115.57,83.82 v115.57,90.17
  Bottom 0.254: R535.2 99.06,92.71 U531.1 113.03,92.71 v115.57,90.17
N$45
  Bottom 2: 20,101 -1,101 -1,80
N$46
  Top 0.254: R537.1 121.92,86.36 R536.2
  Bottom 0.254: U531.6 R536.2
N$47
  Bottom 2: 161,80 161,101 140,101
N$48  (via drill 0.61)
  Top 0.254: X2.1 102.87,92.71 v102.87,88.9
  Bottom 0.254: R537.2 124.46,91.44 119.38,91.44 U531.7 116.84,88.9 v102.87,88.9
N$50
  Top 0.254: J531.1 X2.3
N$51
  Top 0.254: R601.2 R602.2 R604.2 R603.2 | R603.2 U601.2 | R605.1 35.56,20.32 R603.2
N$52
  Top 0.254: U601.1 R605.2 R606.1
N$53
  Top 0.254: R614.2 U611.2 | R614.2 R613.2 58.42,20.32 R615.1 | R614.2 R612.2 R611.2
N$54
  Top 0.254: C601.1 R607.1 43.18,5.08 41.91,3.81 41.91,1.27 33.02,1.27 U601.6 36.83,6.35 36.83,19.05 R606.2
N$55
  Top 0.254: U611.6 57.15,3.81 57.15,5.08 54.61,7.62 54.61,8.89 50.8,8.89 R617.1 C611.1 50.8,20.32 R616.2
N$56
  Top 0.254: R616.1 R615.2
  Bottom 0.254: U611.1 62.23,11.43 57.15,11.43 R615.2
N$57
  Top 0.254: C611.2 R618.1 46.99,11.43 46.99,1.27 59.69,1.27 U611.7
N$58
  Top 0.254: U601.7 40.64,7.62 40.64,10.16 41.91,11.43 41.91,17.78 45.72,17.78 C601.2 R608.1
N$59
  Top 0.254: R701.1 119.38,21.59 132.08,21.59 132.08,29.21 133.35,30.48 U701.2 U701.1
N$60
  Top 0.254: R702.1 119.38,24.13 119.38,33.02 U701.7 U701.6
N$61
  Top 0.254: R621.2 R623.2 R622.2 R624.2 | R624.2 U621.2 | R625.1 80.01,15.24 R624.2
N$63
  Top 0.254: U621.1 R625.2 R626.1
N$64
  Top 0.254: U621.6 78.74,6.35 78.74,7.62 80.01,8.89 85.09,8.89 R627.1 C621.1 85.09,20.32 R626.2
N$65
  Top 0.254: U621.7 78.74,1.27 83.82,1.27 83.82,6.35 87.63,10.16 R628.1 C621.2
N$66
  Top 0.254: U701.8 U701.9 R703.1
N$68
  Top 0.254: R633.2 R634.2 | R635.1 R632.2 R631.2 U631.2
  Bottom 0.254: R631.2 R633.2
N$69
  Top 0.254: R636.1 97.79,15.24 97.79,20.32 | 97.79,20.32 R635.2 | U631.1 104.14,11.43 104.14,13.97 97.79,20.32
N$70
  Top 0.254: U631.6 96.52,6.35 92.71,6.35 R637.1 C631.1 92.71,20.32 R636.2
N$71
  Top 0.254: R638.1 C631.2
  Bottom 0.254: U631.7 104.14,3.81 110.49,3.81 110.49,11.43 91.44,11.43 R638.1
N$72
  Top 0.254: R704.1 133.35,24.13 U701.13 U701.14
N$73
  Top 0.254: J701.1 R701.2
N$74
  Top 0.254: R702.2 125.73,7.62 128.27,7.62 J701.2
N$75
  Top 0.254: R703.2 132.08,12.7 J702.1
N$76
  Top 0.254: J702.2 R704.2
N$77
  Top 0.254: R711.1 152.4,24.13 152.4,33.02 U711.2 U711.1
N$78
  Top 0.254: R712.1 139.7,24.13 139.7,33.02 U711.7
  Bottom 0.254: U711.7 U711.6
N$79
  Top 0.254: R713.1 U711.8 U711.9
N$80
  Top 0.254: U711.13 U711.14 R714.1
N$81
  Bottom 0.254: R711.2 148.59,7.62 139.7,7.62 138.43,6.35 J711.1
N$82
  Top 0.254: R712.2 140.97,10.16 J711.2
N$83
  Top 0.254: R713.2 144.78,8.89 J712.1
N$84
  Bottom 0.254: R714.2 148.59,5.08 J712.2
N$86
  Top 0.508: L202.1 J201.1
N$87
  Top 0.508: L201.1 12.7,93.98 J201.5 J201.4
N$90
  Bottom 0.254: R802.2 24.13,43.18 10.16,43.18 10.16,45.72 19.05,45.72 19.05,48.26 Q801.2
N$92
  Top 0.254: U201.3 16.51,74.93 R201.2 16.51,81.28 C201.1
  Bottom 0.254: D201.C 15.24,83.82 C201.1 | C202.+ 10.16,73.66 U201.3
N$95
  Bottom 0.254: R812.2 22.86,40.64 22.86,35.56 21.59,34.29 19.05,34.29 Q811.2
N$99
  Bottom 0.254: R822.2 25.4,27.94 19.05,27.94 Q821.2
N$103
  Top 0.254: R832.2 24.13,22.86 21.59,20.32 21.59,17.78 19.05,17.78 Q831.2
NOTE_0  (via drill 0.61)
  Top 0.254: U721.3 C721.1 | U403.9 133.35,53.34 127,46.99 v127,41.91
  Bottom 0.254: v127,41.91 99.06,41.91 97.79,43.18 U721.3
NOTE_1  (via drill 0.61)
  Top 0.254: U721.5 C722.1 93.98,49.53 93.98,57.15 v96.52,59.69
  Bottom 0.254: U403.8 135.89,57.15 127,57.15 127,62.23 120.65,62.23 119.38,60.96 119.38,59.69 v96.52,59.69
NOTE_2  (via drill 0.61)
  Top 0.254: C723.1 U721.10 | v157.48,57.15 158.75,55.88 158.75,22.86 v157.48,21.59
  Bottom 0.254: U403.7 138.43,57.15 v157.48,57.15 | v157.48,21.59 111.76,21.59 104.14,29.21 96.52,29.21 96.52,31.75 93.98,31.75 C723.1
NOTE_3  (via drill 0.61)
  Top 0.254: C724.1 U721.12 | U403.6 140.97,62.23 142.24,63.5 154.94,63.5 154.94,39.37 157.48,36.83 v157.48,31.75
  Bottom 0.254: v157.48,31.75 149.86,31.75 149.86,36.83 115.57,36.83 111.76,33.02 C724.1
NOTE_A  (via drill 0.61)
  Top 0.254: v97.79,27.94 101.6,31.75 101.6,39.37 100.33,40.64 U721.2
  Bottom 0.254: R601.1 33.02,27.94 v97.79,27.94 | U721.2 U721.1
NOTE_B
  Top 0.254: R611.1 72.39,29.21 86.36,29.21 86.36,43.18 U721.7
  Bottom 0.254: U721.7 U721.6
NOTE_C
  Top 0.254: R621.1 74.93,27.94 87.63,27.94 U721.8
  Bottom 0.254: U721.8 U721.9
NOTE_D
  Top 0.254: R631.1 U721.14
  Bottom 0.254: U721.14 U721.13
NOTEOUT_A  (via drill 0.61)
  Top 0.254: 44.45,2.54 R608.2 | R607.2 44.45,2.54 | 44.45,2.54 v44.45,13.97
  Bottom 0.254: J601.1 113.03,13.97 v44.45,13.97
NOTEOUT_B  (via drill 0.61)
  Top 0.254: 49.53,2.54 R617.2 | R618.2 49.53,2.54 | 49.53,2.54 v49.53,15.24
  Bottom 0.254: J601.2 115.57,15.24 v49.53,15.24
NOTEOUT_C
  Top 0.254: R627.2 R628.2
  Bottom 0.254: J602.1 115.57,1.27 88.9,1.27 R628.2
NOTEOUT_D
  Top 0.254: R638.2 R637.2 92.71,1.27 119.38,1.27 121.92,3.81 J602.2
PA0  (via drill 0.61)
  Top 0.254: v72.39,68.58 v72.39,55.88
  Bottom 0.254: U102.40 35.56,68.58 v72.39,68.58 | v72.39,55.88 104.14,55.88 106.68,53.34 U404.3
PA1  (via drill 0.61)
  Top 0.254: U102.39 39.37,67.31 39.37,68.58 49.53,68.58 49.53,60.96 57.15,53.34 57.15,38.1 54.61,35.56 50.8,35.56 50.8,33.02 59.69,24.13 59.69,21.59 60.96,20.32 78.74,20.32 78.74,24.13 81.28,26.67 88.9,26.67 v88.9,46.99
  Bottom 0.254: v88.9,46.99 91.44,49.53 106.68,49.53 U404.5
PA2  (via drill 0.61)
  Top 0.254: U102.38 41.91,64.77 v41.91,54.61 | v102.87,54.61 105.41,52.07 105.41,44.45 106.68,43.18 U404.7
  Bottom 0.254: v41.91,54.61 v102.87,54.61
PA3  (via drill 0.61)
  Top 0.254: U102.37 44.45,64.77 44.45,55.88 46.99,53.34 v46.99,46.99 | v78.74,34.29 v82.55,30.48 | v113.03,36.83 115.57,39.37 U404.9
  Bottom 0.254: v46.99,46.99 48.26,45.72 60.96,45.72 72.39,34.29 v78.74,34.29 | v82.55,30.48 86.36,34.29 110.49,34.29 v113.03,36.83
PA4  (via drill 0.61)
  Top 0.254: U102.36 46.99,64.77 46.99,55.88 49.53,53.34 v49.53,30.48
  Bottom 0.254: v49.53,30.48 80.01,30.48 86.36,36.83 86.36,41.91 96.52,41.91 96.52,46.99 114.3,46.99 U404.11
PA5
  Top 0.254: S104.8 R115.2
  Bottom 0.254: U102.35 48.26,63.5 34.29,63.5 24.13,73.66 24.13,76.2 21.59,76.2 21.59,80.01 S104.8
PA6
  Top 0.254: R115.3 S104.7 33.02,78.74 33.02,69.85 49.53,69.85 50.8,68.58 U102.34
PA7
  Top 0.254: R115.4 S104.6 34.29,74.93 45.72,74.93 52.07,68.58 52.07,67.31 U102.33
PB0  (via drill 0.61)
  Top 0.254: S101.2 R113.2 15.24,11.43 15.24,49.53 v17.78,52.07
  Bottom 0.254: U102.1 34.29,52.07 v17.78,52.07
PB1
  Top 0.254: R113.3 S101.3 16.51,2.54 22.86,2.54 25.4,5.08 25.4,12.7 34.29,21.59 34.29,40.64 36.83,43.18 36.83,49.53 U102.2
PB2  (via drill 0.61)
  Top 0.254: S101.4 R113.4 19.05,11.43 16.51,13.97 16.51,41.91 v20.32,45.72
  Bottom 0.254: U102.3 40.64,45.72 v20.32,45.72
PB3
  Top 0.254: S101.5 R113.5 22.86,11.43 22.86,20.32 29.21,26.67 29.21,55.88 31.75,55.88 31.75,53.34 41.91,53.34 41.91,52.07 U102.4
PB4
  Top 0.254: R114.2 S102.1
  Bottom 0.254: U102.5 45.72,48.26 63.5,48.26 73.66,38.1 73.66,35.56 R114.2
PB5
  Top 0.254: U102.6 48.26,41.91 41.91,35.56 36.83,35.56 J102.1
PB6  (via drill 0.61)
  Top 0.254: v50.8,43.18 U102.7
  Bottom 0.254: v50.8,43.18 41.91,43.18 J102.4
PB7  (via drill 0.61)
  Top 0.254: v53.34,36.83 U102.8
  Bottom 0.254: v53.34,36.83 52.07,35.56 41.91,35.56 J102.3
PC0  (via drill 0.61)
  Top 0.254: U102.22 82.55,64.77 v82.55,62.23 | v118.11,60.96 118.11,73.66 125.73,73.66 125.73,69.85 127,68.58 127,66.04 130.81,62.23 132.08,62.23 v132.08,54.61 | v137.16,54.61 139.7,57.15 U401.5
  Bottom 0.254: v82.55,62.23 83.82,60.96 v118.11,60.96 | v132.08,54.61 v137.16,54.61
PC1  (via drill 0.61)
  Top 0.254: v110.49,63.5 110.49,80.01 109.22,81.28 109.22,91.44 113.03,91.44 v113.03,95.25
  Bottom 0.254: U102.23 78.74,63.5 v110.49,63.5 | v113.03,95.25 148.59,95.25 154.94,88.9 154.94,82.55 157.48,80.01 157.48,68.58 144.78,68.58 143.51,67.31 U401.6
PC2  (via drill 0.61)
  Top 0.254: v99.06,68.58 100.33,69.85 v100.33,81.28 | v129.54,81.28 129.54,66.04 130.81,64.77 U401.4
  Bottom 0.254: U102.24 76.2,68.58 v99.06,68.58 | v100.33,81.28 v129.54,81.28
PC3  (via drill 0.61)
  Top 0.254: v102.87,71.12 102.87,82.55 104.14,83.82 104.14,86.36 109.22,92.71 109.22,93.98 111.76,96.52 119.38,96.52 v119.38,83.82
  Bottom 0.254: U102.25 73.66,71.12 v102.87,71.12 | v119.38,83.82 139.7,83.82 140.97,82.55 151.13,82.55 152.4,81.28 152.4,76.2 139.7,76.2 134.62,71.12 134.62,67.31 U401.3
PC4  (via drill 0.61)
  Top 0.254: R802.1 26.67,57.15 22.86,60.96 R801.1 | v71.12,57.15 U102.26
  Bottom 0.254: v71.12,57.15 69.85,55.88 24.13,55.88 22.86,57.15 20.32,57.15 20.32,60.96 R801.1
PC5  (via drill 0.61)
  Top 0.254: R812.1 22.86,52.07 22.86,57.15 R811.1 | U102.27 67.31,64.77 v67.31,57.15
  Bottom 0.254: v67.31,57.15 24.13,57.15 22.86,58.42 R811.1
PC6
  Top 0.254: R822.1 25.4,38.1 25.4,57.15 22.86,59.69 20.32,59.69 20.32,57.15 R821.1
  Bottom 0.254: U102.28 66.04,62.23 20.32,62.23 19.05,60.96 19.05,55.88 R821.1
PC7  (via drill 0.61)
  Top 0.254: R832.1 22.86,38.1 22.86,50.8 21.59,52.07 R831.1 | U102.29 62.23,64.77 v62.23,53.34
  Bottom 0.254: R831.1 v62.23,53.34
PD0  (via drill 0.61)
  Top 0.254: U102.14 69.85,52.07 69.85,71.12 R102.1 71.12,73.66 v68.58,76.2
  Bottom 0.254: U101.6 52.07,74.93 63.5,74.93 64.77,76.2 v68.58,76.2
PD1  (via drill 0.61)
  Top 0.254: U102.15 72.39,52.07 72.39,53.34 82.55,53.34 82.55,48.26 91.44,48.26 91.44,82.55 v92.71,83.82 | v121.92,82.55 124.46,80.01 124.46,76.2 v127,73.66
  Bottom 0.254: v92.71,83.82 116.84,83.82 118.11,82.55 v121.92,82.55 | v127,73.66 130.81,69.85 U401.2
PD2
  Top 0.254: U102.16 74.93,49.53 74.93,46.99 R114.6
  Bottom 0.254: R114.6 S102.5
PD3
  Bottom 0.254: S102.4 R114.5 73.66,43.18 73.66,46.99 76.2,46.99 U102.17
PD4
  Bottom 0.254: R114.4 S102.3 83.82,40.64 83.82,46.99 82.55,48.26 78.74,48.26 U102.18
PD5
  Top 0.254: 78.74,38.1 S102.2 | R114.3 78.74,38.1 | U102.19 80.01,49.53 80.01,48.26 78.74,46.99 78.74,38.1
PD6  (via drill 0.61)
  Top 0.254: S104.5 R115.5 | U102.20 83.82,53.34 74.93,62.23 v74.93,82.55
  Bottom 0.254: v74.93,82.55 73.66,83.82 62.23,83.82 60.96,85.09 38.1,85.09 R115.5
PD7  (via drill 0.61)
  Top 0.254: v83.82,59.69 U102.21 | v58.42,59.69 57.15,60.96 57.15,74.93 58.42,76.2 58.42,91.44 55.88,93.98 J099.2
  Bottom 0.254: v58.42,59.69 v83.82,59.69
PITCH_CV  (via drill 0.61)
  Top 0.254: v60.96,25.4 R612.1 63.5,21.59 64.77,21.59 | R622.1 73.66,21.59 64.77,21.59 | v78.74,92.71 80.01,91.44 v80.01,62.23 | v66.04,60.96 64.77,59.69 64.77,21.59
  Bottom 0.254: R602.1 33.02,25.4 v60.96,25.4 | R632.1 99.06,21.59 76.2,21.59 R622.1 | J531.2 88.9,92.71 v78.74,92.71 | v80.01,62.23 78.74,60.96 v66.04,60.96
PITCH_ZERO
  Top 0.254: R604.1 30.48,25.4 R418.2
  Bottom 0.254: R418.2 R419.2 | 62.23,24.13 R614.1 | 62.23,24.13 76.2,24.13 | 76.2,24.13 R624.1 | R634.1 106.68,24.13 76.2,24.13 | R604.1 34.29,24.13 62.23,24.13
RESET  (via drill 0.61)
  Top 0.254: U102.9 55.88,48.26 R106.2 v54.61,38.1
  Bottom 0.254: J102.5 v54.61,38.1
VELO_0
  Top 0.254: U711.3 C711.1
  Bottom 0.254: U403.5 143.51,62.23 157.48,62.23 158.75,60.96 158.75,36.83 152.4,36.83 C711.1
VELO_1
  Top 0.254: U711.5 C712.1 144.78,39.37 144.78,58.42 U403.4
VELO_2
  Top 0.254: C713.1 U711.10 146.05,27.94 142.24,31.75 142.24,62.23 147.32,62.23 147.32,60.96 U403.3
VELO_3
  Top 0.254: C714.1 U711.12 149.86,27.94 149.86,58.42 U403.2
WHEEL_CV  (via drill 0.61)
  Top 0.254: P501.2 80.01,92.71 81.28,91.44 v81.28,77.47 | v96.52,72.39 97.79,71.12 97.79,53.34 101.6,49.53 101.6,40.64 102.87,39.37 104.14,39.37 104.14,24.13 R633.1
  Bottom 0.254: R603.1 36.83,21.59 57.15,21.59 | 57.15,21.59 R613.1 | 57.15,21.59 71.12,21.59 R623.1 74.93,20.32 102.87,20.32 R633.1 | v81.28,77.47 82.55,76.2 92.71,76.2 v96.52,72.39

## Text on the board
bPlace: PolyDAC(x) | Rev 2012-04